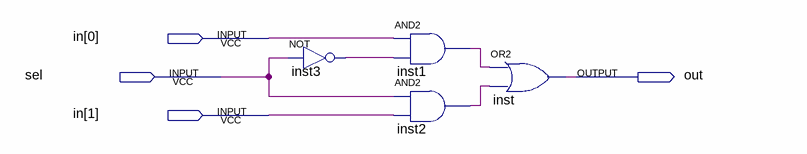
[diagram p0: schematic sheet]
// Quartus schematic mux2to1.bdf as structural Verilog: 4 symbols, 4 pins
module mux2to1 (
  input  [1:0] in,
  input  sel,
  output out
);

  wire inst1_out, inst2_out, inst3_out;

  not inst3 (inst3_out, sel);
  and inst1 (inst1_out, in[0], inst3_out);
  and inst2 (inst2_out, sel, in[1]);
  or inst (out, inst1_out, inst2_out);
endmodule
